# EAGLE schematic EstereliEASY v1 (EAGLE 9.7.0)
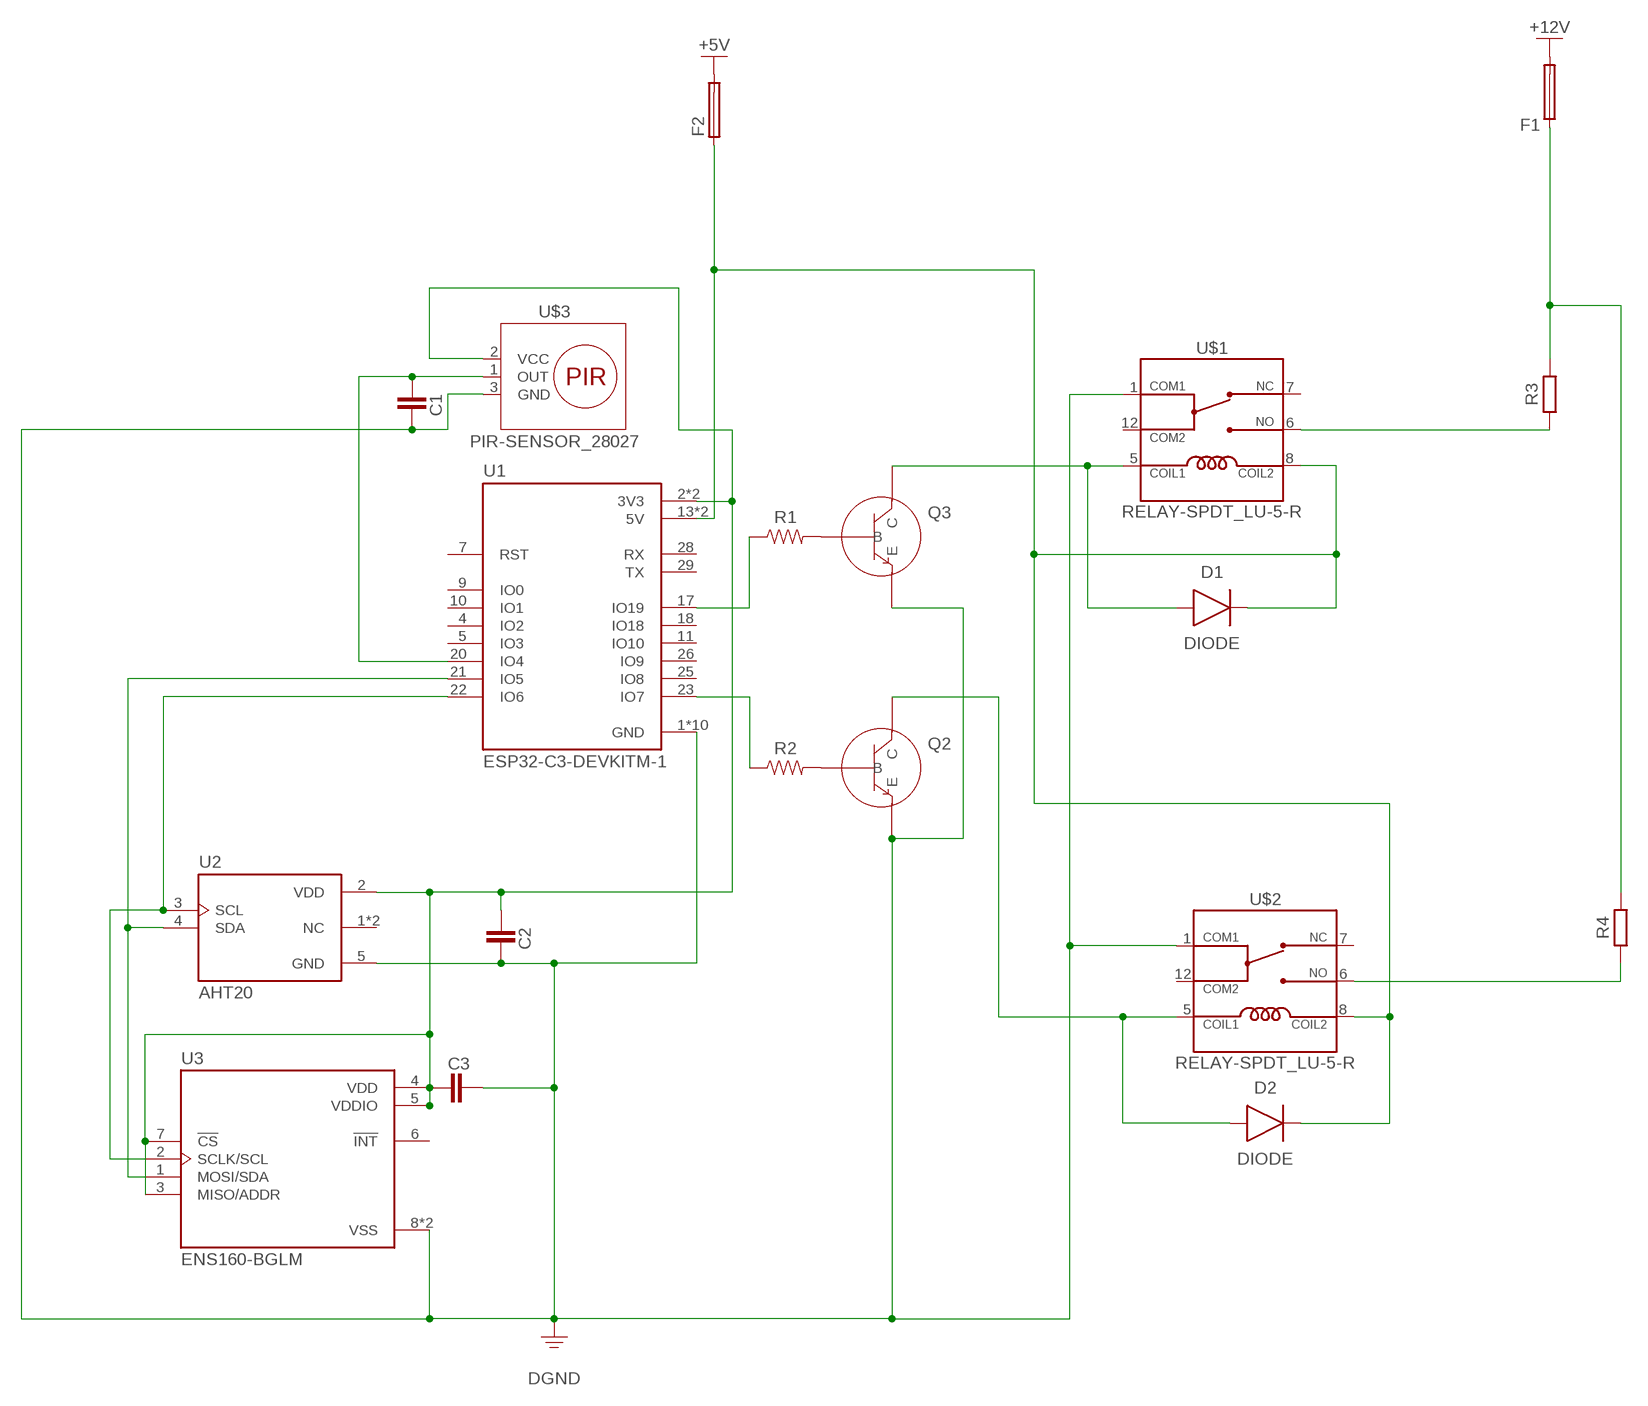
[diagram p0: schematic, sheet 1]

## Parts
C1  CAPACITOR_CHIP-0402(1005-METRIC)  [CAPC1005X60]
C2  CAPACITOR_CHIP-0402(1005-METRIC)  [CAPC1005X60]
C3  CAPACITOR_CHIP-0402(1005-METRIC)  [CAPC1005X60]
D1  DIODE  DIODE_DO-213AA(SOD-80)  [DIOMELF3516]
D2  DIODE  DIODE_DO-213AA(SOD-80)  [DIOMELF3516]
F1  FUSE_AXIAL-26MM-PITCH  [FUSAD2590W70L2150D550B]
F2  FUSE_AXIAL-26MM-PITCH  [FUSAD2590W70L2150D550B]
Q2  BJT_NPN  (no package)
Q3  BJT_NPN  (no package)
R1  R-US_CHIP-0402(1005-METRIC)  [RESC1005X40]
R2  R-US_CHIP-0402(1005-METRIC)  [RESC1005X40]
R3  RESISTOR__CHIP-0402(1005-METRIC)  [RESC1005X40]
R4  RESISTOR__CHIP-0402(1005-METRIC)  [RESC1005X40]
U1  ESP32-C3-DEVKITM-1  [XCVR_ESP32-C3-DEVKITM-1]
U2  AHT20  [PSON100P300X300X110-6N]
U3  ENS160-BGLM  [XDCR_ENS160-BGLM]
U$1  RELAY-SPDT_LU-5-R  [LU-5-R]
U$2  RELAY-SPDT_LU-5-R  [LU-5-R]
U$3  PIR-SENSOR_28027  [28027]

## Nets
+5V: F2.2
+12V: F1.2
DGND: C1.1 C2.1 C3.1 Q2.E Q3.E U1.1(GND) U1.6(GND) U1.8(GND) U1.12(GND) U1.15(GND) U1.16(GND) U1.19(GND) U1.24(GND) U1.27(GND) U1.30(GND) U2.5(GND) U3.8(VSS) U3.9(VSS) U$1.1(COM1) U$2.1(COM1) U$3.3(GND)
N$1: R3.1 U$1.6(NO)
N$2: F1.1 R3.2 R4.2
N$3: U1.22(IO6) U2.3(SCL) U3.2(SCLK/SCL)
N$4: U1.21(IO5) U2.4(SDA) U3.1(MOSI/SDA)
N$5: C2.2 C3.2 U1.2(3V3) U1.3(3V3) U2.2(VDD) U3.3(MISO/ADDR) U3.4(VDD) U3.5(VDDIO) U3.7(!CS) U$3.2(VCC)
N$6: Q3.B R1.2
N$7: Q2.B R2.2
N$8: R1.1 U1.17(IO19)
N$9: R2.1 U1.23(IO7)
N$10: D1.2(A) Q3.C U$1.5(COIL1)
N$11: D2.2(A) Q2.C U$2.5(COIL1)
N$12: C1.2 U1.20(IO4) U$3.1(OUT)
N$13: D1.1(C) D2.1(C) F2.1 U1.13(5V) U1.14(5V) U$1.8(COIL2) U$2.8(COIL2)
N$14: R4.1 U$2.6(NO)
Unconnected: U1.4(IO2) U1.5(IO3) U1.7(RST) U1.9(IO0) U1.10(IO1) U1.11(IO10) U1.18(IO18) U1.25(IO8) U1.26(IO9) U1.28(RX) U1.29(TX) U2.1(NC) U2.6(NC) U3.6(!INT) U$1.7(NC) U$1.12(COM2) U$2.7(NC) U$2.12(COM2)

## Library data of the parts
C1-C3 = Tinkercad:CAPACITOR: Capacitor - Generic; CATEGORY: Capacitor
D1 D2 = Tinkercad:DIODE: Diode Rectifier - Generic; CATEGORY: Diode; SUB-CATEGORY: Rectifier
F1 F2 = Circuit-Protection:FUSE: Fuse - Generic; CATEGORY: Circuit-Protection; PACKAGE_SIZE: 26MM-PITCH; PACKAGE_TYPE: THT; SUBCATEGORY: Fuse; TYPE: Axial
Q2 Q3 = ngspice-simulation:BJT_NPN: Bipolar NPN Transistor
R1 R2 = Resistor:R-US: Resistor Fixed - ANSI; CATEGORY: Resistors; DESCRIPTION: Chip Resistor 1.05 X 0.54 X 0.40 mm body 0402(1005-METRIC) Package; PACKAGE_SIZE: 0402; PACKAGE_TYPE: SMD
R3 R4 = Tinkercad:RESISTOR: Resistor Fixed - Generic; CATEGORY: Resistor; SUB-CATEGORY: Fixed
U1 = ESP32-C3-DEVKITM-1:ESP32-C3-DEVKITM-1: Check availability <https://pricing.snapeda.com/parts/ESP32-C3-DEVKITM-1/Espressif%20Systems/view-part?ref=eda>; AVAILABILITY: In Stock; CHECK_PRICES: https://www.snapeda.com/parts/ESP32-C3-DEVKITM-1/Espressif+Systems/view-part/?ref=eda; DESCRIPTION: WiFi Development Tools (802.11) (ENGINEERING SAMPLE ONLY) ESP32-C3 General-Purpose Dev Board, Embeds ESP32-C3-MINI-1, 4 MB Flash, w/ Pin Header; MF: Espressif Systems; MP: ESP32-C3-DEVKITM-1; PACKAGE: None; PRICE: None; SNAPEDA_LINK: https://www.snapeda.com/parts/ESP32-C3-DEVKITM-1/Espressif+Systems/view-part/?ref=snap
U2 = AHT20:AHT20: Check availability <https://pricing.snapeda.com/parts/AHT20/Asair/view-part?ref=eda>; AVAILABILITY: Not in stock; CHECK_PRICES: https://www.snapeda.com/parts/AHT20/Asair/view-part/?ref=eda; DESCRIPTION: Temperature and Humidity sensor; MF: Asair; MP: AHT20; PACKAGE: Package; PRICE: None; SNAPEDA_LINK: https://www.snapeda.com/parts/AHT20/Asair/view-part/?ref=snap
U3 = ENS160-BGLM:ENS160-BGLM: Check availability <https://pricing.snapeda.com/parts/ENS160-BGLM/ScioSense/view-part?ref=eda>; AVAILABILITY: In Stock; CHECK_PRICES: https://www.snapeda.com/parts/ENS160-BGLM/ScioSense/view-part/?ref=eda; DESCRIPTION: Versatile digital air quality sensor for building automation, appliances & consumer applications; MF: ScioSense; MP: ENS160-BGLM; PACKAGE: LGA-9 ScioSense; PRICE: None; SNAPEDA_LINK: https://www.snapeda.com/parts/ENS160-BGLM/ScioSense/view-part/?ref=snap
U$1 U$2 = Tinkercad:RELAY-SPDT
U$3 = Tinkercad:PIR-SENSOR